# Altium schematic sheet CV_Control.SchDoc
size Letter
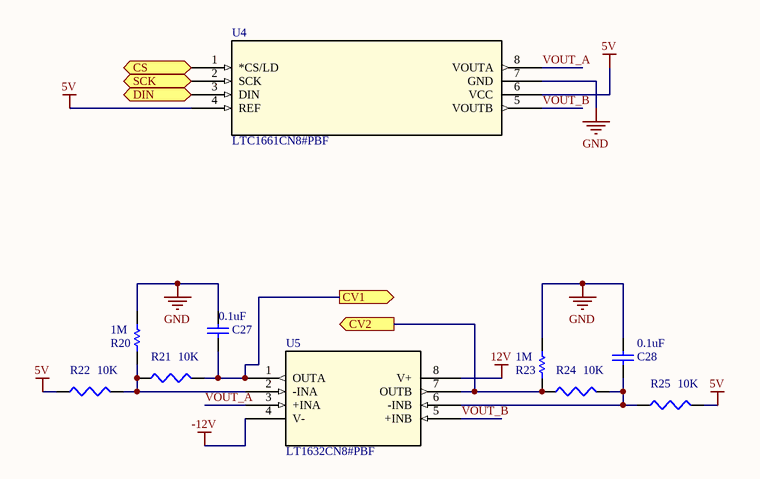
[diagram p0: CV_Control.SchDoc]

## Parts
C27  value 0.1uF  [RAD-0.3]  (hidden comment: Cap)
C28  value 0.1uF  [RAD-0.3]  (hidden comment: Cap)
R20  value 1M  [AXIAL-0.3]  (hidden comment: Res1)
R21  value 10K  [J1-0603]  (hidden comment: Res3)
R22  value 10K  [J1-0603]  (hidden comment: Res3)
R23  value 1M  [AXIAL-0.3]  (hidden comment: Res1)
R24  value 10K  [J1-0603]  (hidden comment: Res3)
R25  value 10K  [J1-0603]  (hidden comment: Res3)
U4  LTC1661CN8#PBF  [PDIP-8_N]
U5  LT1632CN8#PBF  [PDIP-8_N]

## Ports
CS (in), CV1 (out), CV2 (out), DIN, SCK

## Nets
5V: R22.1 R25.2 U4.4(REF) U4.6(VCC)
12V: U5.8(V+)
-12V: U5.4(V-)
GND: C27.2 C28.2 R20.2 R23.2 U4.7(GND)
CS: U4.1(*CS/LD) ; port CS
CV1: C27.1 R21.2 U5.1(OUTA) ; port CV1
CV2: R23.1 R24.1 U5.7(OUTB) ; port CV2
DIN: U4.3(DIN) ; port DIN
SCK: U4.2(SCK) ; port SCK
VOUT_A: U4.8(VOUTA) U5.3(+INA)
VOUT_B: U4.5(VOUTB) U5.5(+INB)
NetC28_1: C28.1 R24.2 R25.1 U5.6(-INB)
NetR20_1: R20.1 R21.1 R22.2 U5.2(-INA)

## Library data of the parts
C27 C28 = Cap: Capacitor; Published: 8-Jun-2000; LatestRevisionDate: 17-Jul-2002; LatestRevisionNote: Re-released for DXP Platform.; PackageReference: RAD-0.3; Publisher: Altium Limited; PackageDescription: Radial Cap, Thru-Hole; 2 Leads; 0.3 in Pin Spacing
R20 R23 = Res1: Resistor; Published: 8-Jun-2000; LatestRevisionDate: 17-Jul-2002; LatestRevisionNote: Re-released for DXP Platform.; PackageReference: AXIAL-0.3; Publisher: Altium Limited; PackageDescription: Axial Device, Thru-Hole; 2 Leads; 0.3 in Pin Spacing
R21 R22 R24 R25 = Res3: Resistor; Published: 8-Jun-2000; LatestRevisionDate: 29-May-2009; LatestRevisionNote: IPC-7351 Footprint Added.; PackageReference: J1-0603; Publisher: Altium Limited; PackageDescription: Chip Resistor
U4 = LTC1661CN8#PBF: Imported; Vendor: Linear Technology; Manufacturer_Part_Number: LTC1661CN8#PBF; Value: Value; Type: Type; RefDes: RefDes
U5 = LT1632CN8#PBF: Imported; Operating_Temperature: 0Â°C ~ 70Â°C; Current_-_Output_/_Channel: 70mA; Voltage_-_Input_Offset: 500ÂµV; Current_-_Input_Bias: 1.15ÂµA; Output_Type: Rail-to-Rail; Vendor: Linear Technology; Amplifier_Type: General Purpose; Number_of_Circuits: 2; Slew_Rate: 45 V/Âµs; Gain_Bandwidth_Product: 45MHz; Current_-_Supply: 4.6mA; Current_-_Output/Channel: 40mA; Voltage_-_Supply,_Single/Dual_(Â±): 2.7 V ~ 36 V, Â±1.35 V ~ 18 V; Mounting_Type: Through Hole; 3D_Library_Name: Maxim2; C: Copyright (C) 2016 Accelerated Designs. All rights reserved; -3db_Bandwidth: -; Series: *; Manufacturer_Part_Number: LT1632CN8#PBF; DigiKeyPartNumber: LT1632CN8-ND; Quantity_Available: 0; DataSheet: http://www.linear.com/docs/3055; Packaging: Tube; Package_/_Case: 8-DIP (0.300", 7.62mm); Copyright: Copyright (C) 2015 Accelerated Designs. All rights reserved; Supplier_Device_Package: 8-PDIP; Value: Value; Type: Type; RefDes: RefDes